# EAGLE schematic LevelShifter (EAGLE 7.1.0)
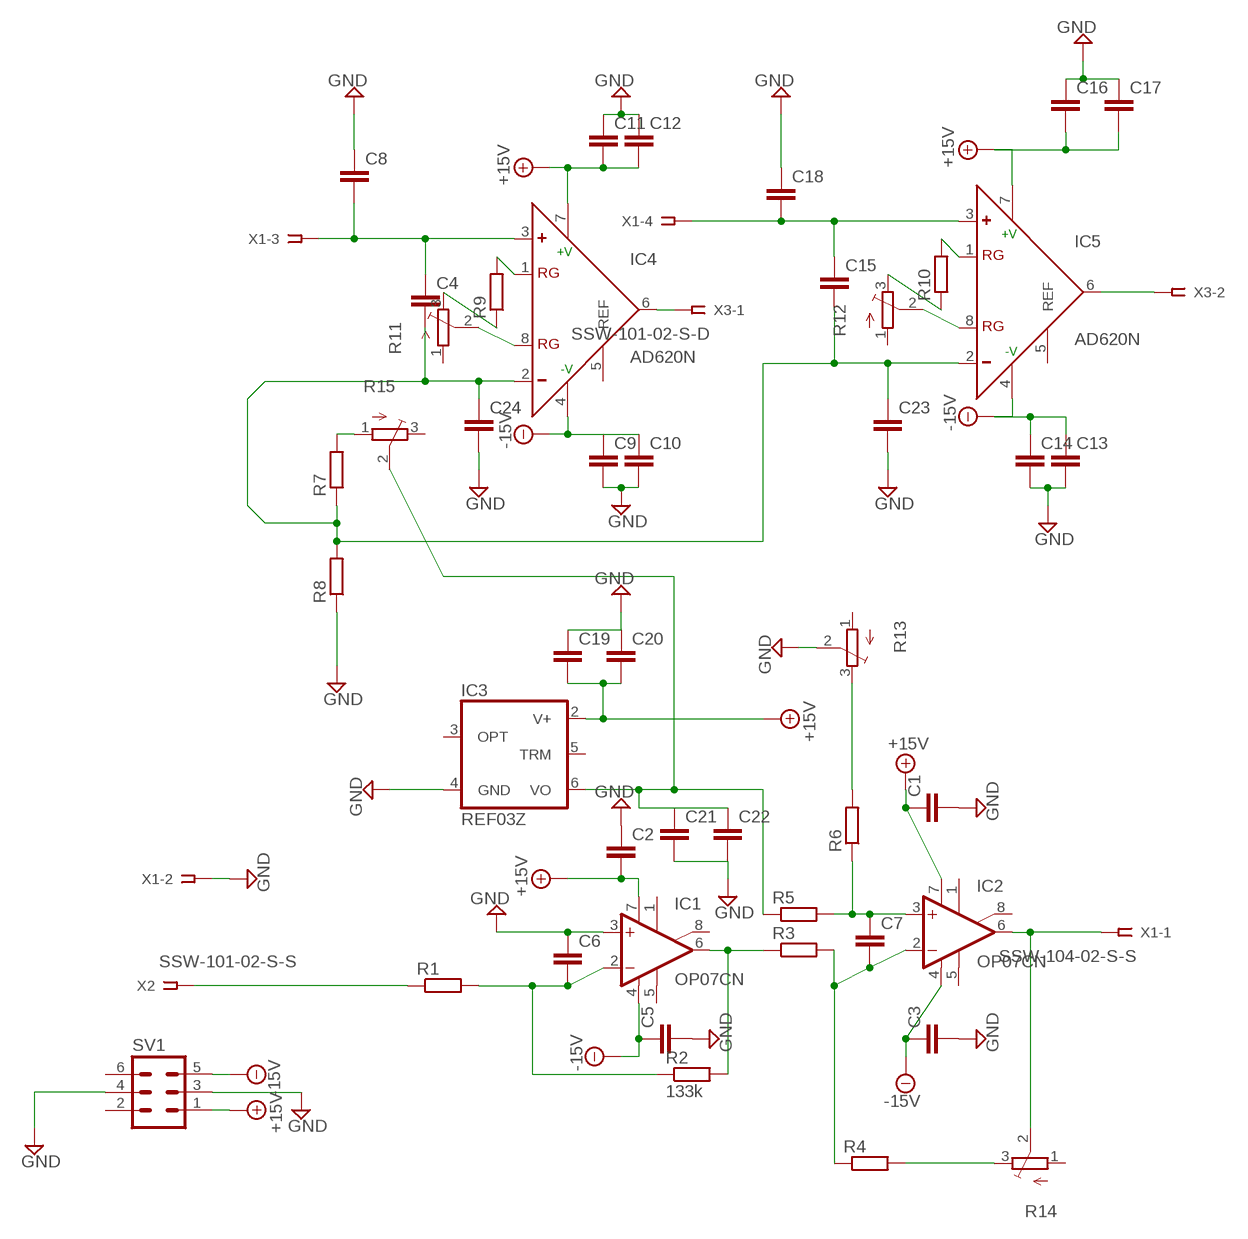
[diagram p0: schematic, sheet 1]

## Parts
C1  C-EUC0805  [C0805]
C2  C-EUC0805  [C0805]
C3  C-EUC0805  [C0805]
C4  C-EUC0805  [C0805]
C5  C-EUC0805  [C0805]
C6  C-EUC0805  [C0805]
C7  C-EUC0805  [C0805]
C8  C-EUC0805  [C0805]
C9  C-EUC0805  [C0805]
C10  C-EUC0805  [C0805]
C11  C-EUC0805  [C0805]
C12  C-EUC0805  [C0805]
C13  C-EUC0805  [C0805]
C14  C-EUC0805  [C0805]
C15  C-EUC0805  [C0805]
C16  C-EUC0805  [C0805]
C17  C-EUC0805  [C0805]
C18  C-EUC0805  [C0805]
C19  C-EUC0805  [C0805]
C20  C-EUC0805  [C0805]
C21  C-EUC0805  [C0805]
C22  C-EUC0805  [C0805]
C23  C-EUC0805  [C0805]
C24  C-EUC0805  [C0805]
IC1  OP07CN  [DIL08]
IC2  OP07CN  [DIL08]
IC3  REF03Z  [DIL08]
IC4  AD620N  [DIL08]
IC5  AD620N  [DIL08]
R1  R-EU_R0805  [R0805]
R2  133k  R-EU_R0805  [R0805]
R3  R-EU_R0805  [R0805]
R4  R-EU_R0805  [R0805]
R5  R-EU_R0805  [R0805]
R6  R-EU_R0805  [R0805]
R7  R-EU_R0805  [R0805]
R8  R-EU_R0805  [R0805]
R9  R-EU_R0805  [R0805]
R10  R-EU_R0805  [R0805]
R11  TRIM_EU-SM-42/43W  [SM-42/43W]
R12  TRIM_EU-SM-42/43W  [SM-42/43W]
R13  TRIM_EU-SM-42/43W  [SM-42/43W]
R14  TRIM_EU-SM-42/43W  [SM-42/43W]
R15  TRIM_EU-SM-42/43W  [SM-42/43W]
SV1  MA03-2  [MA03-2]
X1  SSW-104-02-S-S  [SSW-104-02-S-S]
X2  SSW-101-02-S-S  [SSW-101-02-S-S]
X3  SSW-101-02-S-D  [SSW-101-02-S-D]

## Nets
+15V: C1.1 C2.2 C11.2 C12.2 C16.2 C17.2 C19.2 C20.2 IC1.7(V+) IC2.7(V+) IC3.2(V+) IC4.7(+V) IC5.7(+V) SV1.1
-15V: C3.1 C5.1 C9.1 C10.1 C13.1 C14.1 IC1.4(V-) IC2.4(V-) IC4.4(-V) IC5.4(-V) SV1.5
GND: C1.2 C2.1 C3.2 C5.2 C6.1 C8.1 C9.2 C10.2 C11.1 C12.1 C13.2 C14.2 C16.1 C17.1 C18.1 C19.1 C20.1 C21.2 C22.2 C23.2 C24.2 IC1.3(+IN) IC3.4(GND) R8.1 R13.2(S) SV1.3 SV1.4 X1.2
N$1: C6.2 IC1.2(-IN) R1.2 R2.1
N$2: C4.1 C8.2 IC4.3(+) X1.3
N$3: IC1.6(OUT) R2.2 R3.1
N$5: C7.2 IC2.2(-IN) R3.2 R4.1
N$6: C7.1 IC2.3(+IN) R5.2 R6.1
N$7: C21.1 C22.1 IC3.6(VO) R5.1 R15.2(S)
N$9: IC4.8(RG) R11.2(S)
N$10: R9.1 R11.3(E)
N$11: IC4.1(RG) R9.2
N$12: IC5.1(RG) R10.2
N$14: R7.2 R15.1(A)
N$15: IC5.8(RG) R12.2(S)
N$16: C15.1 C18.2 IC5.3(+) X1.4
N$18: C4.2 C15.2 C23.1 C24.1 IC4.2(-) IC5.2(-) R7.1 R8.2
N$21: R10.1 R12.3(E)
N$22: R4.2 R14.3(E)
N$23: R6.2 R13.3(E)
N$24: R1.1 X2.1
N$25: IC4.6(OUT) X3.1
N$26: IC5.6(OUT) X3.2
N$27: IC2.6(OUT) R14.2(S) X1.1
Unconnected: IC1.1(ON1) IC1.5(OPT) IC1.8(ON2) IC2.1(ON1) IC2.5(OPT) IC2.8(ON2) IC3.3(OPT) IC3.5(TRM) IC4.5(REF) IC5.5(REF) R11.1(A) R12.1(A) R13.1(A) R14.1(A) R15.3(E) SV1.2 SV1.6

## Library data of the parts
C1-C24 = rcl:C-EU: CAPACITOR, European symbol
IC1 IC2 = linear:OP07*: OP AMP
IC3 = linear:REF03: VOLTAGE REFERENCE
IC4 IC5 = analog-devices:AD620: Low Cost, Low Power, Instrumentation Amplifier Source: http://www.analog.com/UploadedFiles/Data_Sheets/37793330023930AD620_e.pdf; MF: ALTERA CORPORATION; MPN: AD620AN; OC_FARNELL: 1523782; OC_NEWARK: 05F7108
R1-R10 = rcl:R-EU_: RESISTOR, European symbol
R11-R15 = pot:TRIM_EU-: POTENTIOMETER
SV1 = con-lstb:MA03-2: PIN HEADER; OC_FARNELL: unknown; OC_NEWARK: unknown
X1 = con-samtec:SSW-104-02-S-S: THROUGH-HOLE .025" SQ POST SOCKET Source: Samtec SSW.pdf; MPN: SSW-104-02-S-S; OC_FARNELL: unknown; OC_NEWARK: 11P9384
X2 = con-samtec:SSW-101-02-S-S: THROUGH-HOLE .025" SQ POST SOCKET Source: Samtec SSW.pdf; MPN: SSW-101-02-S-S; OC_FARNELL: unknown; OC_NEWARK: 11P9336
X3 = con-samtec:SSW-101-02-S-D: THROUGH-HOLE .025" SQ POST SOCKET Source: Samtec SSW.pdf; MPN: SSW-101-02-S-D; OC_FARNELL: unknown; OC_NEWARK: 82P1456